# EAGLE design Adafruit I2C SPI LCD STEMMA backpack (EAGLE 9.6.2)
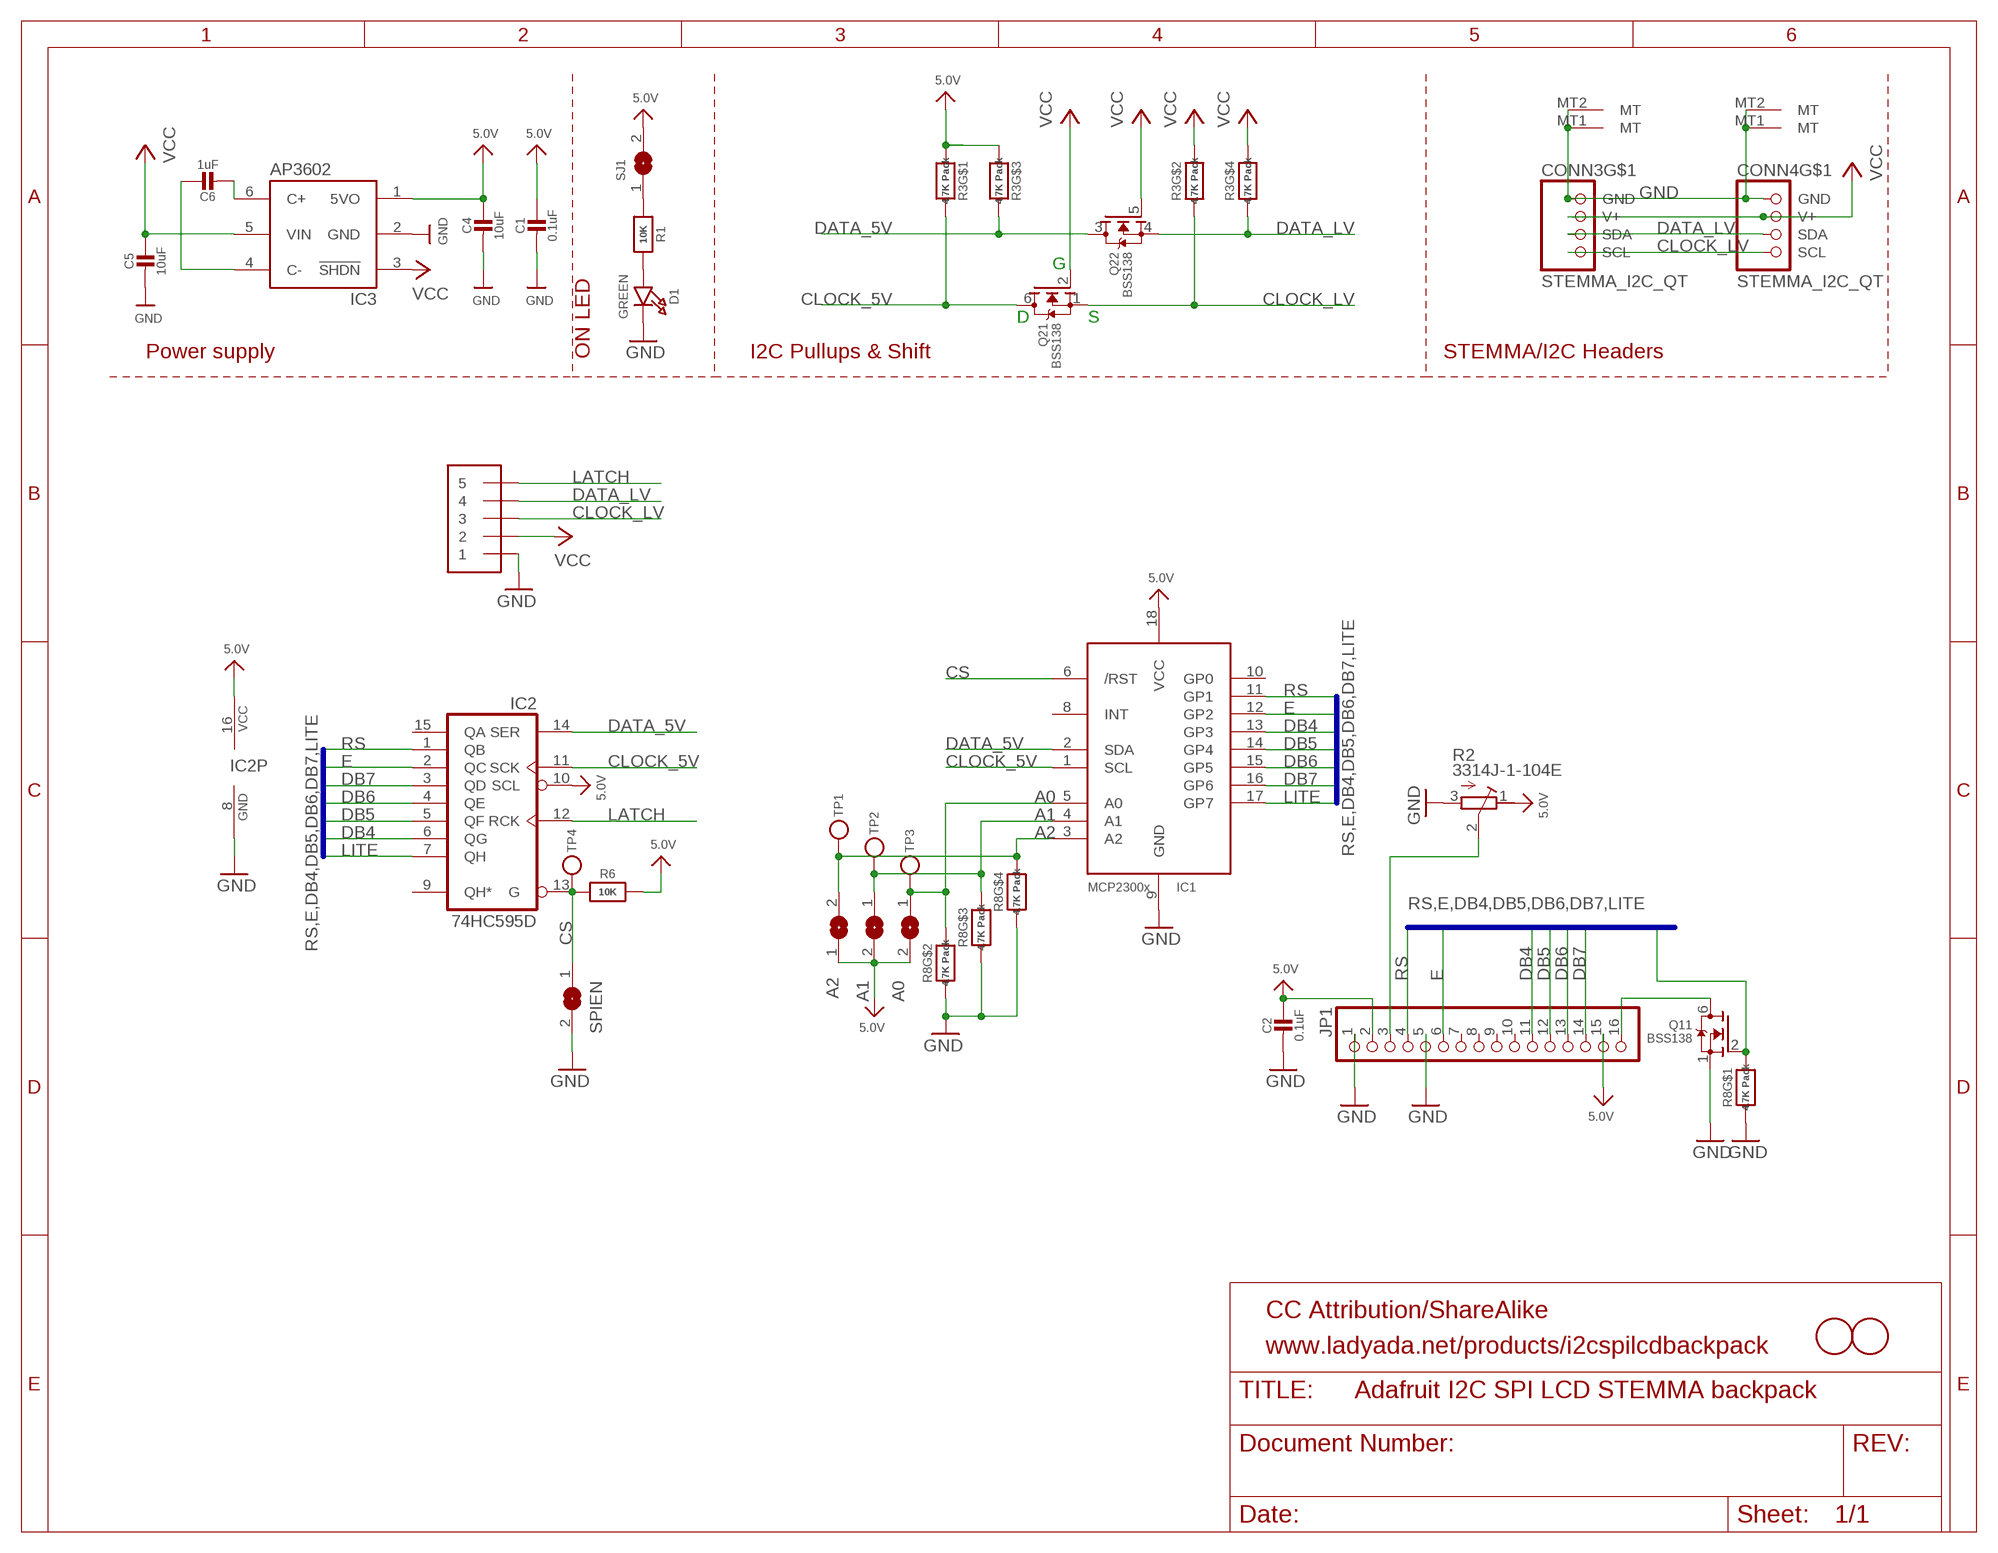
[diagram p0: schematic, sheet 1]

## Parts
A0  SOLDERJUMPER  [SOLDERJUMPER_ARROW_NOPASTE]
A1  SOLDERJUMPER  [SOLDERJUMPER_ARROW_NOPASTE]
A2  SOLDERJUMPER  [SOLDERJUMPER_ARROW_NOPASTE]
C1  0.1uF  CAP_CERAMIC0603_NO  [0603-NO]
C2  0.1uF  CAP_CERAMIC0603_NO  [0603-NO]
C4  10uF  CAP_CERAMIC0805-NOOUTLINE  [0805-NO]
C5  10uF  CAP_CERAMIC0805-NOOUTLINE  [0805-NO]
C6  1uF  CAP_CERAMIC0805-NOOUTLINE  [0805-NO]
CONN3  STEMMA_I2C_QT  [JST_SH4]
CONN4  STEMMA_I2C_QT  [JST_SH4]
D1  GREEN  LED0603_NOOUTLINE  [CHIPLED_0603_NOOUTLINE]
IC1  MCP23008/SO  [SO18W]
IC2  74HC595D  74LS595D  [SO16]
IC3  AP3602/RT9361  AP3602  [SOT23-6]
J1  1X5  [1X05-3.5MM]
JP1  PINHD-1X16  [1X16]
Q1  BSS138  MOSFET-N_DUAL  [SOT363]
Q2  BSS138  MOSFET-N_DUAL  [SOT363]
R1  10K  RESISTOR_0603_NOOUT  [0603-NO]
R2  3314J-1-104E  R-TRIMM3314J  [RTRIM3314J]
R3  4.7K Pack  RESISTOR_4PACK  [RESPACK_4X0603]
R6  10K  RESISTOR_0603_NOOUT  [0603-NO]
R8  4.7K Pack  RESISTOR_4PACK  [RESPACK_4X0603]
SJ1  SOLDERJUMPERCLOSED  [SOLDERJUMPER_CLOSEDWIRE]
SPIEN  SOLDERJUMPER  [SOLDERJUMPER_ARROW_NOPASTE]
TP1  TESTPOINTROUND1.5MM  [TESTPOINT_ROUND_1.5MM]
TP2  TESTPOINTROUND1.5MM  [TESTPOINT_ROUND_1.5MM]
TP3  TESTPOINTROUND1.5MM  [TESTPOINT_ROUND_1.5MM]
TP4  TESTPOINTROUND1.5MM  [TESTPOINT_ROUND_1.5MM]
U$1  FIDUCIAL  [FIDUCIAL_1MM]
U$2  FIDUCIAL  [FIDUCIAL_1MM]

## Nets
5.0V: A0.2 A1.2 A2.1 C1.1 C2.1 C4.1 IC1.18(VCC) IC2.10(SCL) IC2.16(VCC) IC3.1(5VO) JP1.2 JP1.15 R2.1(E) R3.1 R3.3 R6.1 SJ1.2
A0: A0.1 IC1.5(A0) R8.7 TP3.P$1
A1: A1.1 IC1.4(A1) R8.6 TP2.P$1
A2: A2.2 IC1.3(A2) R8.5 TP1.P$1
CLOCK_5V: IC1.1(SCL) IC2.11(SCK) Q2.6(1:D) R3.8
CLOCK_LV: CONN3.4(SCL) CONN4.4(SCL) J1.3 Q2.1(1:S) R3.7
CONTRAST: JP1.3 R2.2(S)
CS: IC1.6(/RST) IC2.13(G) R6.2 SPIEN.1 TP4.P$1
DATA_5V: IC1.2(SDA) IC2.14(SER) Q2.3(2:D) R3.6
DATA_LV: CONN3.3(SDA) CONN4.3(SDA) J1.4 Q2.4(2:S) R3.5
DB4: IC1.13(GP3) IC2.6(QG) JP1.11
DB5: IC1.14(GP4) IC2.5(QF) JP1.12
DB6: IC1.15(GP5) IC2.4(QE) JP1.13
DB7: IC1.16(GP6) IC2.3(QD) JP1.14
E: IC1.12(GP2) IC2.2(QC) JP1.6
GND: C1.2 C2.2 C4.2 C5.2 CONN3.1(GND) CONN3.MT1(MT) CONN3.MT2(MT) CONN4.1(GND) CONN4.MT1(MT) CONN4.MT2(MT) D1.C IC1.9(GND) IC2.8(GND) IC3.2(GND) J1.1 JP1.1 JP1.5 Q1.1(1:S) R2.3(A) R8.1 R8.2 R8.3 R8.4 SPIEN.2
LATCH: IC2.12(RCK) J1.5
LEDK: JP1.16 Q1.6(1:D)
LITE: IC1.17(GP7) IC2.7(QH) Q1.2(1:G) R8.8
N$1: D1.A R1.2
N$2 [lowpower]: R1.1 SJ1.1
N$3: C6.2 IC3.6(C+)
N$4: C6.1 IC3.4(C-)
RS: IC1.11(GP1) IC2.1(QB) JP1.4
VCC: C5.1 CONN3.2(V+) CONN4.2(V+) IC3.3(!SHDN) IC3.5(VIN) J1.2 Q2.2(1:G) Q2.5(2:G) R3.2 R3.4
Unconnected: IC1.8(INT) IC1.10(GP0) IC2.9(QH*) IC2.15(QA) JP1.7 JP1.8 JP1.9 JP1.10 Q1.3(2:D) Q1.4(2:S) Q1.5(2:G)

## Buses
RS,E,DB4,DB5,DB6,DB7,LITE

## Notes on the sheet
- G
- D | S
- Power supply | ON LED | I2C Pullups & Shift | STEMMA/I2C Headers
- CC Attribution/ShareAlike
- www.ladyada.net/products/i2cspilcdbackpack

## Library data of the parts
A0 A1 A2 SPIEN = microbuilder:SOLDERJUMPER: SMD Solder JUMPER Solder the two pads together to create a connection, or remove the solder to break it. REFLOW - Use this footprint for solder paste and reflow ovens. WAVE - Use this footprint for hand-soldering (larger pads). CLOSED - Has a trace between the two pads to ensure it is closed by default. The trace needs to be cut to disable the jumper, and can be closed again by creating a solder bridge between the two pads.; BOM: EXCLUDE
C1 C2 C4-C6 = microbuilder:CAP_CERAMIC: Ceramic Capacitors For new designs, use the packages preceded by an '_' character since they are more reliable: The following footprints should be used on most boards: _0402 - Standard footprint for regular board layouts _0603 - Standard footprint for regular board layouts _0805 - Standard footprint for regular board layouts _1206 - Standard footprint for regular board layouts For extremely tight-pitch boards where space is at a premium, the following 'micro-pitch' footprints can be used (smaller pads, no silkscreen outline, etc.): _0402MP - Micro-pitch footprint for very dense/compact boards _0603MP - Micro-pitch footprint for very dense/compact boards _0805MP - Micro-pitch footprint for very dense/compact boards _1206MP - Micro-pitch footprint for very dense/compact boards
CONN3 CONN4 = adafruit_electromech:STEMMA_I2C; LCSC: C2845363
D1 = microbuilder:LED: LED 0603 - 0603 Surface Mount Package 2mA: Green LED - Low Power (3.9mcd, 2ma, 1.7Vf) - Digikey: 475-2709-2-ND Orange LED - Low Power (9.8mcd, 2ma, 1.8Vf) - Digikey: 475-1194-2-ND Red LED - Low Power (5mcd, 2ma, 1.8Vf) - Digikey: 475-1195-2-ND Yellow LED - Low Power (7mcd, 2ma, 1.8Vf) - Digikey: 475-1196-2-ND 5mA: Blue LED - Low Power (17mcd, 5ma, 2.9Vf) - Digikey: LNJ937W8CRACT-ND 0805 - 0805 Surface Mount Package 2mA: Red LED (8.8mcd, 2mA, 1.8Vf, Clear) - Low Power [Digikey: 475-2510-1-ND] Green LED (5mcd, 2mA, 1.8Vf, Clear) - Low Power [Digikey: 475-2730-1-ND] Yellow LED (11.3mcd, 2mA, 1.8Vf, Clear) - Low Power [Digikey: 475-2555-1-ND] 20mA: Red LED (104mcd, 20mA, Diffused) - LS R976 [Digikey: 475-1278-6-ND] Red LED (12mcd, 20mA, 2.0Vf, Clear) - APT2012EC [Digikey: 754-1128-1-ND] Green LED (15mcd, 20mA, 2.2Vf, Clear) - APT2012GC [Digikey: 754-1131-1-ND] Orange LED (160mcd, 20mA, 2.1Vf, Clear) - APT2012SECK [Digikey: 754-1130-1-ND] 1206 - 1206 Surface Mount Package Green LED (26mcd, 20mA, Diffused) - LG N971 [Digikey: 475-1407-6-ND] Red LED (15mcd, 20mA, Diffused) - LH N974 [Digikey: 475-1416-6-ND] Cree - Cree High-Power Surface Mount LEDs XPEBWT-L1-0000-00D50 - White 111lm 350mA 2.9Vf 6200K 110° XTEAWT-00-0000-00000LEE3 - White 114lm 350mA 2.85Vf 5000K 115° Everlight - Everlight 45-21 Series Surface Mount LEDs 45-21/QK2C-B2832AC2CB2/2T - Warm White 2000mcd 20mA 3.25Vf 3050K 120° 45-21/LK2C-B38452C4CB2/2T - Nuetral White 2000mcd 20mA 3.25Vf 4150K 120° 45-21/LK2C-B50634C6CB2/2T - Cold White 2200mcd 20mA 3.25Vf 5650K 120° PLCC2 Reverse Mount LS T77K-J1L2-1-0-2-R18-Z - Red 11.25mcd 2mA 1.8Vf 630nm 120° LO T77K-L1M2-24-Z - Orange 19.6mcd 2mA 1.8Vf 606nm 120° LY T77K-K2M1-26-Z - Yellow 15.7mcd 2mA 1.8Vf 587nm 120°; ROT: 270
IC1 = adafruit:MCP23008: MCP23008 Inexpensive i2c i/o expander - 8 general purpose i/o pins with optional pullups
IC2 = 74xx-us:74*595: 8-bit SHIFT REGISTER, output latch
IC3 = microbuilder:AP3602
J1 = adafruit:1X5
JP1 = pinhead:PINHD-1X16: PIN HEADER
Q1 Q2 = microbuilder:MOSFET-N_DUAL: Dual N-Channel MOSFET SOT363 (2.0x1.25mm) 2N7002PS - 60V, 320mA [Digikey: 568-5984-1-ND]; JLC_ROTATION: 270
R1 R6 = microbuilder:RESISTOR: Resistors For new designs, use the packages preceded by an '_' character since they are more reliable: The following footprints should be used on most boards: _0402 - Standard footprint for regular board layouts _0603 - Standard footprint for regular board layouts _0805 - Standard footprint for regular board layouts _1206 - Standard footprint for regular board layouts For extremely tight-pitch boards where space is at a premium, the following 'micro-pitch' footprints can be used (smaller pads, no silkscreen outline, etc.): _0402MP - Micro-pitch footprint for very dense/compact boards _0603MP - Micro-pitch footprint for very dense/compact boards _0805MP - Micro-pitch footprint for very dense/compact boards _1206MP - Micro-pitch footprint for very dense/compact boards
R2 = adafruit_electromech:R-TRIMM: Trimm resistor; SPICEMODEL: X; SPICEPREFIXL: POT
R3 R8 = microbuilder:RESISTOR_4PACK: Resistor Packs (4 resistors) 4 x 0603 10K 1/16W - Digikey: YC164J-10KCT-ND
SJ1 = microbuilder:SOLDERJUMPER: SMD Solder JUMPER Solder the two pads together to create a connection, or remove the solder to break it. REFLOW - Use this footprint for solder paste and reflow ovens. WAVE - Use this footprint for hand-soldering (larger pads). CLOSED - Has a trace between the two pads to ensure it is closed by default. The trace needs to be cut to disable the jumper, and can be closed again by creating a solder bridge between the two pads.
TP1-TP4 = microbuilder:TESTPOINT: Test Point Various test points for characterisation and PCB testing TESTPOINT_SMT - Compact Surface Mount Test Point [Digikey: 5016KTR-ND]
U$1 U$2 = adafruit:FIDUCIAL: For use by pick and place machines to calibrate the vision/machine, 1mm By microbuilder.eu

## Net classes
1 highpower: width 0.305 mm, drill 0.483 mm
2 lowpower: width 0.254 mm, drill 0.483 mm

## Board
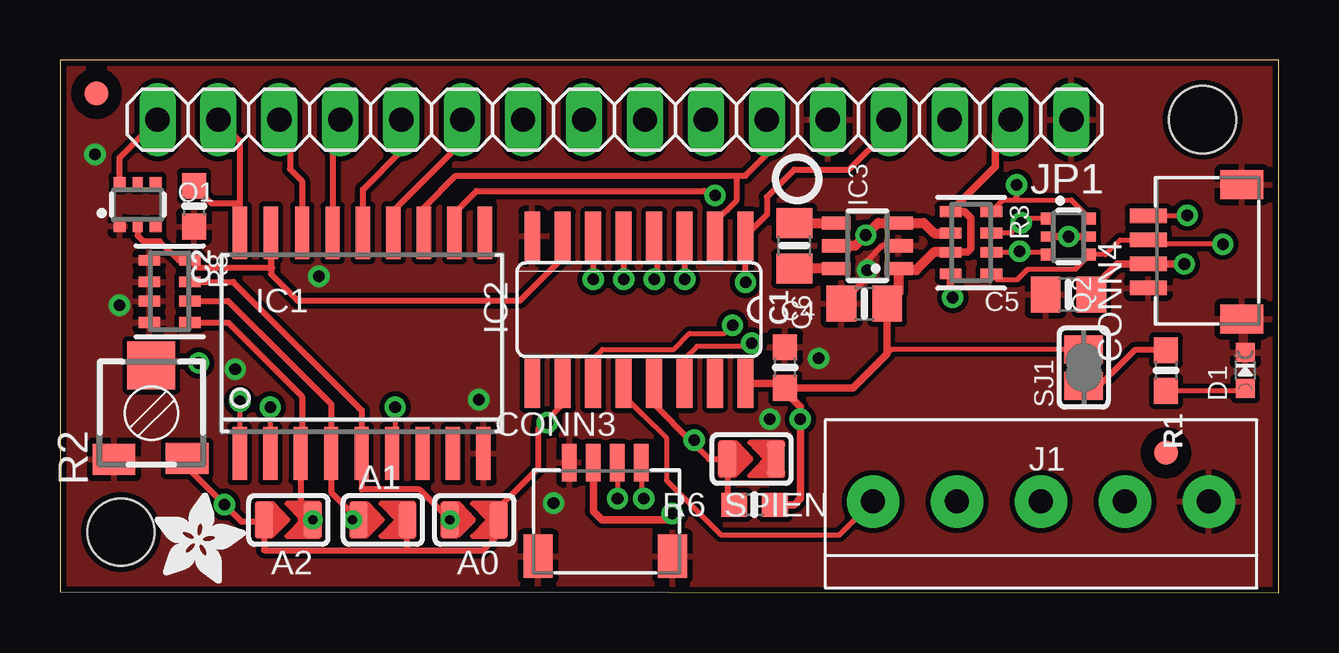
[diagram p1: board, top side]
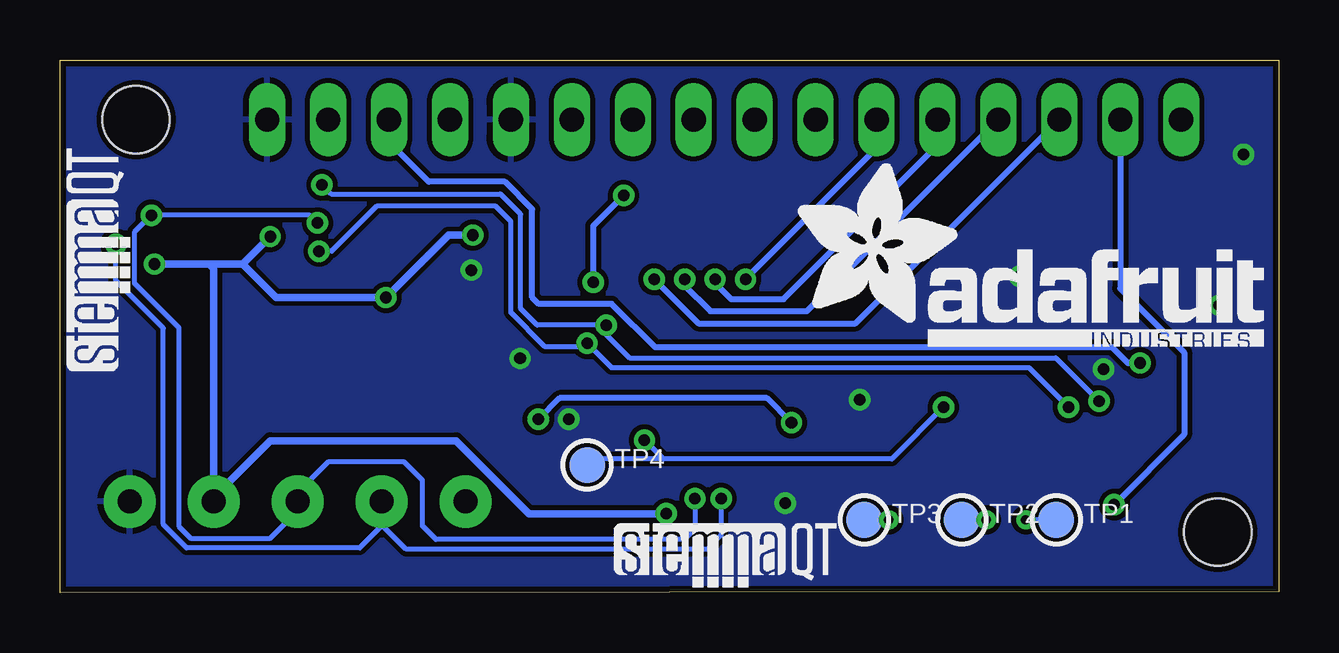
[diagram p2: board, bottom side, seen from below]

Size 50.8 x 22.23 mm. Coordinates in mm from the lower left corner, seen from the top.
Outline: 0.01,0.04 50.8,0 50.8,22.23 0,22.23 0.01,0.04
Copper layers (1*16): Top 0.035mm / dielectric 1.5mm / Bottom 0.035mm
Design rules "adafruit 8-8": minimum track width 6mil, minimum drill 15.5mil, track to track 8mil, track to pad 8mil, pad to pad 8mil, via to via 8mil, smd to smd 8mil, copper to edge 10mil, drill to drill 8mil, minimum pad ring 10mil, minimum via ring 8mil, stop-mask expansion 2mil, vias tented up to drill 20mil, thermal gap 10mil
Holes 2.8 mm at 47.62,19.74 2.54,2.54

### Footprints (pad centres in the part's own frame; a part is rotated, then mirrored left to right if it is on the bottom)
SOLDERJUMPER_ARROW_NOPASTE = smd 0.762 x 1.524: 1 -1.016,0; 2 1.016,0
0603-NO = smd 1.075 x 1: 1 -0.85,0; 2 0.85,0
0805-NO = smd 1.24 x 1.5: 1 -0.95,0; 2 0.95,0
JST_SH4 = smd 0.6 x 1.55: 1 -1.5,2.006; 2 -0.5,2.006; 3 0.5,2.006; 4 1.5,2.006 | smd 1.2 x 1.8: MT1 -2.8,-1.894; MT2 2.8,-1.894
CHIPLED_0603_NOOUTLINE = smd 0.8 x 0.8: A 0,-0.75; C 0,0.75
SO18W = smd 0.6 x 2.2: 1 -5.095,-4.6; 2 -3.825,-4.6; 3 -2.555,-4.6; 4 -1.285,-4.6; 5 -0.015,-4.6; 6 1.255,-4.6; 7 2.525,-4.6; 8 3.795,-4.6; 9 5.065,-4.6; 10 5.125,4.6; 11 3.855,4.6; 12 2.585,4.6; 13 1.315,4.6; 14 0.045,4.6; 15 -1.225,4.6; 16 -2.495,4.6; 17 -3.795,4.6; 18 -5.095,4.6
SO16 = smd 0.66 x 2.032: 1 -4.445,-3.073; 2 -3.175,-3.073; 3 -1.905,-3.073; 4 -0.635,-3.073; 5 0.635,-3.073; 6 1.905,-3.073; 7 3.175,-3.073; 8 4.445,-3.073; 9 4.445,3.073; 10 3.175,3.073; 11 1.905,3.073; 12 0.635,3.073; 13 -0.635,3.073; 14 -1.905,3.073; 15 -3.175,3.073; 16 -4.445,3.073
SOT23-6 = smd 0.55 x 1.2: 1 -0.95,-1.3; 2 0,-1.3; 3 0.95,-1.3; 4 0.95,1.3; 5 0,1.3; 6 -0.95,1.3
1X05-3.5MM = drill 1 pad 2.184: 1 7,0; 2 3.5,0; 3 0,0; 4 -3.5,0; 5 -7,0
1X16 = drill 1.016 long: 1 -19.05,0; 2 -16.51,0; 3 -13.97,0; 4 -11.43,0; 5 -8.89,0; 6 -6.35,0; 7 -3.81,0; 8 -1.27,0; 9 1.27,0; 10 3.81,0; 11 6.35,0; 12 8.89,0; 13 11.43,0; 14 13.97,0; 15 16.51,0; 16 19.05,0
SOT363 = smd 0.5 x 0.5: 1 -0.75,-0.9; 3 0.75,-0.9; 4 0.75,0.9; 6 -0.75,0.9 | smd 0.4 x 0.5: 2 0,-0.9; 5 0,0.9
RTRIM3314J = smd 1.778 x 1.3: 1 1.492,-1.883; 3 -1.556,-1.927 | smd 2 x 2: 2 0,2
RESPACK_4X0603 = smd 0.45 x 0.9: 1 -1.3,-0.85; 2 -0.4,-0.85; 3 0.4,-0.85; 4 1.3,-0.85; 5 1.3,0.85; 6 0.4,0.85; 7 -0.4,0.85; 8 -1.3,0.85
SOLDERJUMPER_CLOSEDWIRE = smd 1.168 x 1.6: 1 -0.762,0; 2 0.762,0 | smd 0.635 x 0.203: WIRE 0,0
TESTPOINT_ROUND_1.5MM = smd 1.5 x 1.5: P$1 0,0
FIDUCIAL_1MM = smd 1 x 1: 1 0,0

### Placement (x,y rotation side)
A0  17.27,3.05 0 top
A1  13.46,3.05 0 top
A2  9.53,3.05 0 top
C1  30.23,9.4 90 top
C2  5.59,16.13 270 top
C4  33.53,12.06 180 top
C5  42.04,12.45 180 top
C6  30.61,14.48 270 top
CONN3  22.73,3.43 0 top
CONN4  47.37,14.22 90 top
D1  49.4,9.27 0 top
IC1  12.59,10.41 0 top
IC2  24.13,11.81 180 top
IC3  33.66,14.48 90 top
J1  40.89,3.81 0 top
JP1  23.11,19.74 180 top
PLABEL0  [PLABEL0]  45.21,7.49 90 top
PLABEL1  [PLABEL1]  48.39,7.37 90 top
PLABEL2  [PLABEL2]  37.97,7.62 90 top
PLABEL3  [PLABEL3]  41.4,7.62 90 top
PLABEL4  [PLABEL4]  34.29,7.75 90 top
PLABEL5  [PLABEL5]  8.38,0.64 0 top
PLABEL6  [PLABEL6]  12.45,0.76 0 top
PLABEL7  [PLABEL7]  16.51,0.76 0 top
PLABEL8  [PLABEL8]  29.02,2.35 0 top
PLABEL9  [PLABEL9]  1.27,6.73 90 top
PLABEL10  [PLABEL10]  6.99,16.51 0 top
PLABEL11  [PLABEL11]  29.02,1.08 0 top
PLABEL12  [PLABEL12]  46.48,6.6 0 bottom
Q1  3.24,16.19 0 top
Q2  42.04,14.86 270 top
R1  46.1,9.27 270 top
R2  3.81,7.49 0 top
R3  37.97,14.61 270 top
R6  28.96,3.68 180 top
R8  4.57,12.57 270 top
SJ1  42.67,9.4 90 top
SPIEN  28.83,5.59 0 top
TP1  9.27,3.05 0 bottom
TP2  13.21,3.05 0 bottom
TP3  17.27,3.05 0 bottom
TP4  28.83,5.33 0 bottom
U$1  1.52,20.83 0 top
U$2  46.1,5.84 0 top
U$4  [ADAFRUIT_3.5MM]  3.94,0.38 0 top
U$7  [PCBFEAT-REV-040]  30.73,17.27 0 top
U$11  [STEMMAQT]  47.88,9.27 90 bottom
U$12  [STEMMAQT]  27.69,0.25 0 bottom
U$23  [ADAFRUIT_TEXT_20MM]  20.19,10.29 0 bottom

### Tracks (layer width: path | path; a pad name or v marks a point on that pad's centre or on a via)
5.0V  (via drill 0.48)
  Top 0.203: SJ1.2 34.67,10.16 34.48,9.97
  Top 0.254: A2.1 8.76,2.98 8.38,2.98 | 8.38,2.98 8.51,2.95 8.51,1.78 14.48,1.78 | 14.48,1.78 A1.2 | 14.48,1.78 17.65,1.78 18.29,2.41 A0.2 18.03,3.3 19.94,5.21 19.94,6.86 20.32,7.24 | JP1.15 7.49,18.85 7.49,16.26 | 7.49,16.26 IC1.18 | 20.32,7.24 20.95,7.87 IC2.10 | 20.32,7.24 v20.32,7.11 v20.31,7.1 | C2.1 6.31,16.26 7.49,16.26 | R2.1 5.3,5.24 v6.86,3.68 7.56,2.98 8.38,2.98
  Top 0.305: C1.1 30.04,8.74 IC2.16 | C1.1 33.06,8.55 34.48,9.97 C4.1 | R6.1 30.61,3.68 30.86,3.94 v30.86,7.24 30.86,7.75 30.23,8.38 C1.1 | JP1.2 38.99,19.1 38.99,17.77 R3.1 37.69,15.9 37.97,15.62 37.97,14.35 37.83,14.21 R3.3
  Top 0.406: IC3.1 34.95,13.46 | 34.95,13.46 34.95,12.54 C4.1 | R3.3 36.43,14.21 35.69,13.46 34.95,13.46
  Bottom 0.254: v20.31,7.1 21.34,8.13 29.97,8.13 v30.86,7.24 | JP1.15 6.6,12.7 3.94,10.03 3.94,6.6 v6.86,3.68
A0  (via drill 0.39)
  Top 0.254: A0.1 14.99,4.32 12.57,4.32 IC1.5 12.57,7.62 7.22,12.97 R8.7
  Bottom 0.203: TP3.P$1 A0.1
  other vias: 16.26,3.05
A1  (via drill 0.39)
  Top 0.254: R8.6 7,12.17 11.3,7.87 IC1.4 11.3,4.19 A1.1 v12.19,3.05
  Bottom 0.203: TP2.P$1 v12.19,3.05
A2  (via drill 0.39)
  Top 0.254: A2.2 10.03,3.05 IC1.3 10.09,5.87 10.09,8.2 7.01,11.27 R8.5
  Bottom 0.203: TP1.P$1 A2.2
  other vias: 10.54,3.05
CLOCK_5V  (via drill 0.48)
  Top 0.203: R3.8 39.3,16.38 39.75,16.38 | Q2.6 42.16,16.38 39.75,16.38 | IC2.11 22.23,9.78 22.61,10.16 25.59,10.16 26.25,10.82 27.69,10.82 v28.03,11.16 | v39.88,17.02 39.88,16.51 39.75,16.38 | v7.49,8 IC1.1
  Bottom 0.203: v39.88,17.02 39.5,16.64 32.45,16.64 31.6,15.79 31.6,11.85 30.91,11.16 v28.03,11.16 28.03,10.79 27.05,9.8 9.3,9.8 v7.49,8
CLOCK_LV  (via drill 0.48)
  Top 0.203: v46.99,15.75 46.97,15.72 CONN4.4 | CONN3.4 24.23,4.04 v24.33,3.94 | Q2.1 40.25,15.61 v40.07,15.43 39.64,15.01 R3.7
  Bottom 0.203: v40.07,15.43 40.39,15.75 v46.99,15.75 47.7,15.04 47.7,12.91 45.85,11.07 45.85,2.78 45.35,2.29 42.04,2.29 40.89,3.43 J1.3 40.89,4.19 39.62,5.46 36.45,5.46 35.69,4.7 35.69,2.79 35.13,2.23 24.77,2.23 24.33,2.67 v24.33,3.94
CONTRAST  (via drill 0.48)
  Top 0.254: v5.78,9.59 5.71,9.65 3.97,9.65 R2.2
  Bottom 0.254: v5.78,9.59 6.29,9.59 6.93,10.24 25.98,10.24 27.8,12.05 30.85,12.05 31.11,12.32 31.11,16 32.26,17.14 35.43,17.14 37.08,18.8 JP1.3
CS  (via drill 0.48)
  Top 0.203: v13.97,7.75 13.97,6.17 IC1.6 | v26.44,6.37 26.35,6.29
  Top 0.254: IC2.13 24.77,7.87 26.35,6.29 27.05,5.59 SPIEN.1 27.81,3.98 R6.2
  Bottom 0.203: v13.97,7.75 16.13,5.59 25.65,5.59 | 25.65,5.59 v26.44,6.37 | 25.65,5.59 28.57,5.59 TP4.P$1
DATA_5V  (via drill 0.48)
  Top 0.203: R3.6 39.96,14.21 | 39.96,14.21 41.04,14.21 Q2.3 | IC2.14 26.04,9.78 26.54,10.29 28.7,10.29 v28.83,10.41 | v40.01,14.25 39.96,14.21 | v8.76,7.75 IC1.2
  Bottom 0.203: v40.01,14.25 39.47,14.25 37.59,16.13 32.64,16.13 32,15.49 32,11.68 30.61,10.29 28.96,10.29 v28.83,10.41 27.81,9.4 10.41,9.4 v8.76,7.75
DATA_LV  (via drill 0.48)
  Top 0.203: R3.5 39.08,13.05 39.89,13.05 40.34,13.5 42.33,13.5 Q2.4 43.57,14.11 44.19,14.72 CONN4.3 45.55,14.54 v48.47,14.54 | CONN3.3 v23.24,3.94
  Bottom 0.203: v23.24,3.94 23.24,2.41 23.82,1.83 36.37,1.83 37.39,2.85 J1.4 37.39,2.79 38.31,1.88 45.52,1.88 46.5,2.85 46.5,11.04 48.47,13.02 v48.47,14.54
DB4  (via drill 0.48)
  Top 0.254: IC1.13 13.9,15.94 16.76,18.8 JP1.11 | IC2.6 v22.23,13.08
  Bottom 0.254: v22.23,13.08 16.76,18.54 JP1.11
DB5  (via drill 0.48)
  Top 0.254: IC1.14 12.63,16.82 14.22,18.41 JP1.12 | IC2.5 v23.5,13.08
  Bottom 0.254: v23.5,13.08 23.5,12.93 22.82,12.26 20.64,12.26 14.22,18.67 JP1.12
DB6  (via drill 0.48)
  Top 0.254: JP1.13 11.36,19.41 IC1.15 | v24.77,13.08 24.89,13.08 24.89,14.76 IC2.4
  Bottom 0.254: v24.77,13.08 24.77,12.83 23.69,11.75 19.67,11.75 JP1.13
DB7  (via drill 0.48)
  Top 0.254: JP1.14 9.14,19.23 9.59,18.79 9.59,17.68 10.09,17.17 IC1.16 | IC2.3 v26.04,13.08
  Bottom 0.254: v26.04,13.08 24.19,11.24 17.64,11.24 JP1.14
E
  Top 0.254: JP1.6 29.46,18.29 28.57,17.4 28.19,17.4 | IC1.12 15.17,16.07 16.5,17.4 28.19,17.4 | 28.19,17.4 28.19,16.37 27.3,15.48 IC2.2
GND  (via drill 0.48)
  Top 0.254: IC3.2 34.29,14.48 33.66,13.84 v33.66,13.46 33.66,13.14 C4.2
  other vias: 31.62,9.78 29.59,7.24 20.57,3.75 17.46,8.06 10.79,13.21 7.3,9.33 1.46,18.29 2.48,12
  pour Bottom: 0,22.23 0,0 50.8,0 50.8,22.23
  pour Top: 0,22.23 0,0 50.8,0 50.8,22.23
LATCH
  Top 0.203: IC2.12 23.5,8.23 24.31,7.42 24.33,7.42 25.27,6.48 25.27,4.7 27.56,2.41 32.5,2.41 J1.5
LEDK
  Top 0.254: Q1.6 2.49,18.16 JP1.16
LITE
  Top 0.254: IC2.7 20.95,13.97 19.18,12.19 9.91,12.19 8.79,13.3 IC1.17 8.79,13.68 8.85,13.56 5.74,13.56 R8.8 4.94,13.87 4.16,14.66 3.49,14.66 3.24,14.91 Q1.2
N$1
  Top 0.203: D1.A 49.3,8.42 R1.2
N$2
  Top 0.254: R1.1 44.79,10.12 43.31,8.64 SJ1.1
N$3
  Top 0.406: IC3.6 C6.2
N$4
  Top 0.406: C6.1 IC3.4
RS  (via drill 0.48)
  Top 0.254: JP1.4 34.54,19.3 32.89,17.65 30.61,17.65 29.46,16.51 29.46,15.77 IC2.1 v28.57,12.95 | IC1.11 16.44,15.84 17.36,16.76 26.86,16.76 27.18,16.45 v27.3,16.57
  Bottom 0.254: v27.3,16.57 28.57,15.3 v28.57,12.95
VCC  (via drill 0.48)
  Top 0.305: Q2.5 v42.04,14.86 Q2.2 | C5.1 42.99,12.63 44.08,13.72 CONN4.2 v46.85,13.72 v46.86,13.72 | R3.4 37.12,12.41 v37.21,12.32 | CONN3.2 22.23,3.4 22.59,3.05 25.27,3.05 v25.53,3.3
  Top 0.406: IC3.5 33.15,14.48 v33.59,14.92 34.1,15.43 IC3.3 36.01,15.43 36.45,14.99 37.1,14.99 R3.2
  Bottom 0.305: v33.59,14.92 34.61,14.92 v37.21,12.32 41.78,12.32 43.18,13.72 | v46.86,13.72 44.58,13.72 | 44.58,13.72 43.18,13.72 | 43.18,13.72 v42.04,14.86 | 44.58,13.72 44.39,13.53 J1.2 44.39,3.99 42.04,6.35 34.29,6.35 31.24,3.3 v25.53,3.3

### Text on the board
Pinguin_tBackup: I2C / SPI LCD backpack | Contrast | LAT | DAT | CLK | 3-5V | GND | SPI | A2 | A1 | A0 | Enable
Pinguin_bBackup: I2C or SPI / Character LCD Backpack / Vin/Vlogic: 3~5V DC